# EAGLE design DeckardsHelper (EAGLE 9.5.2)
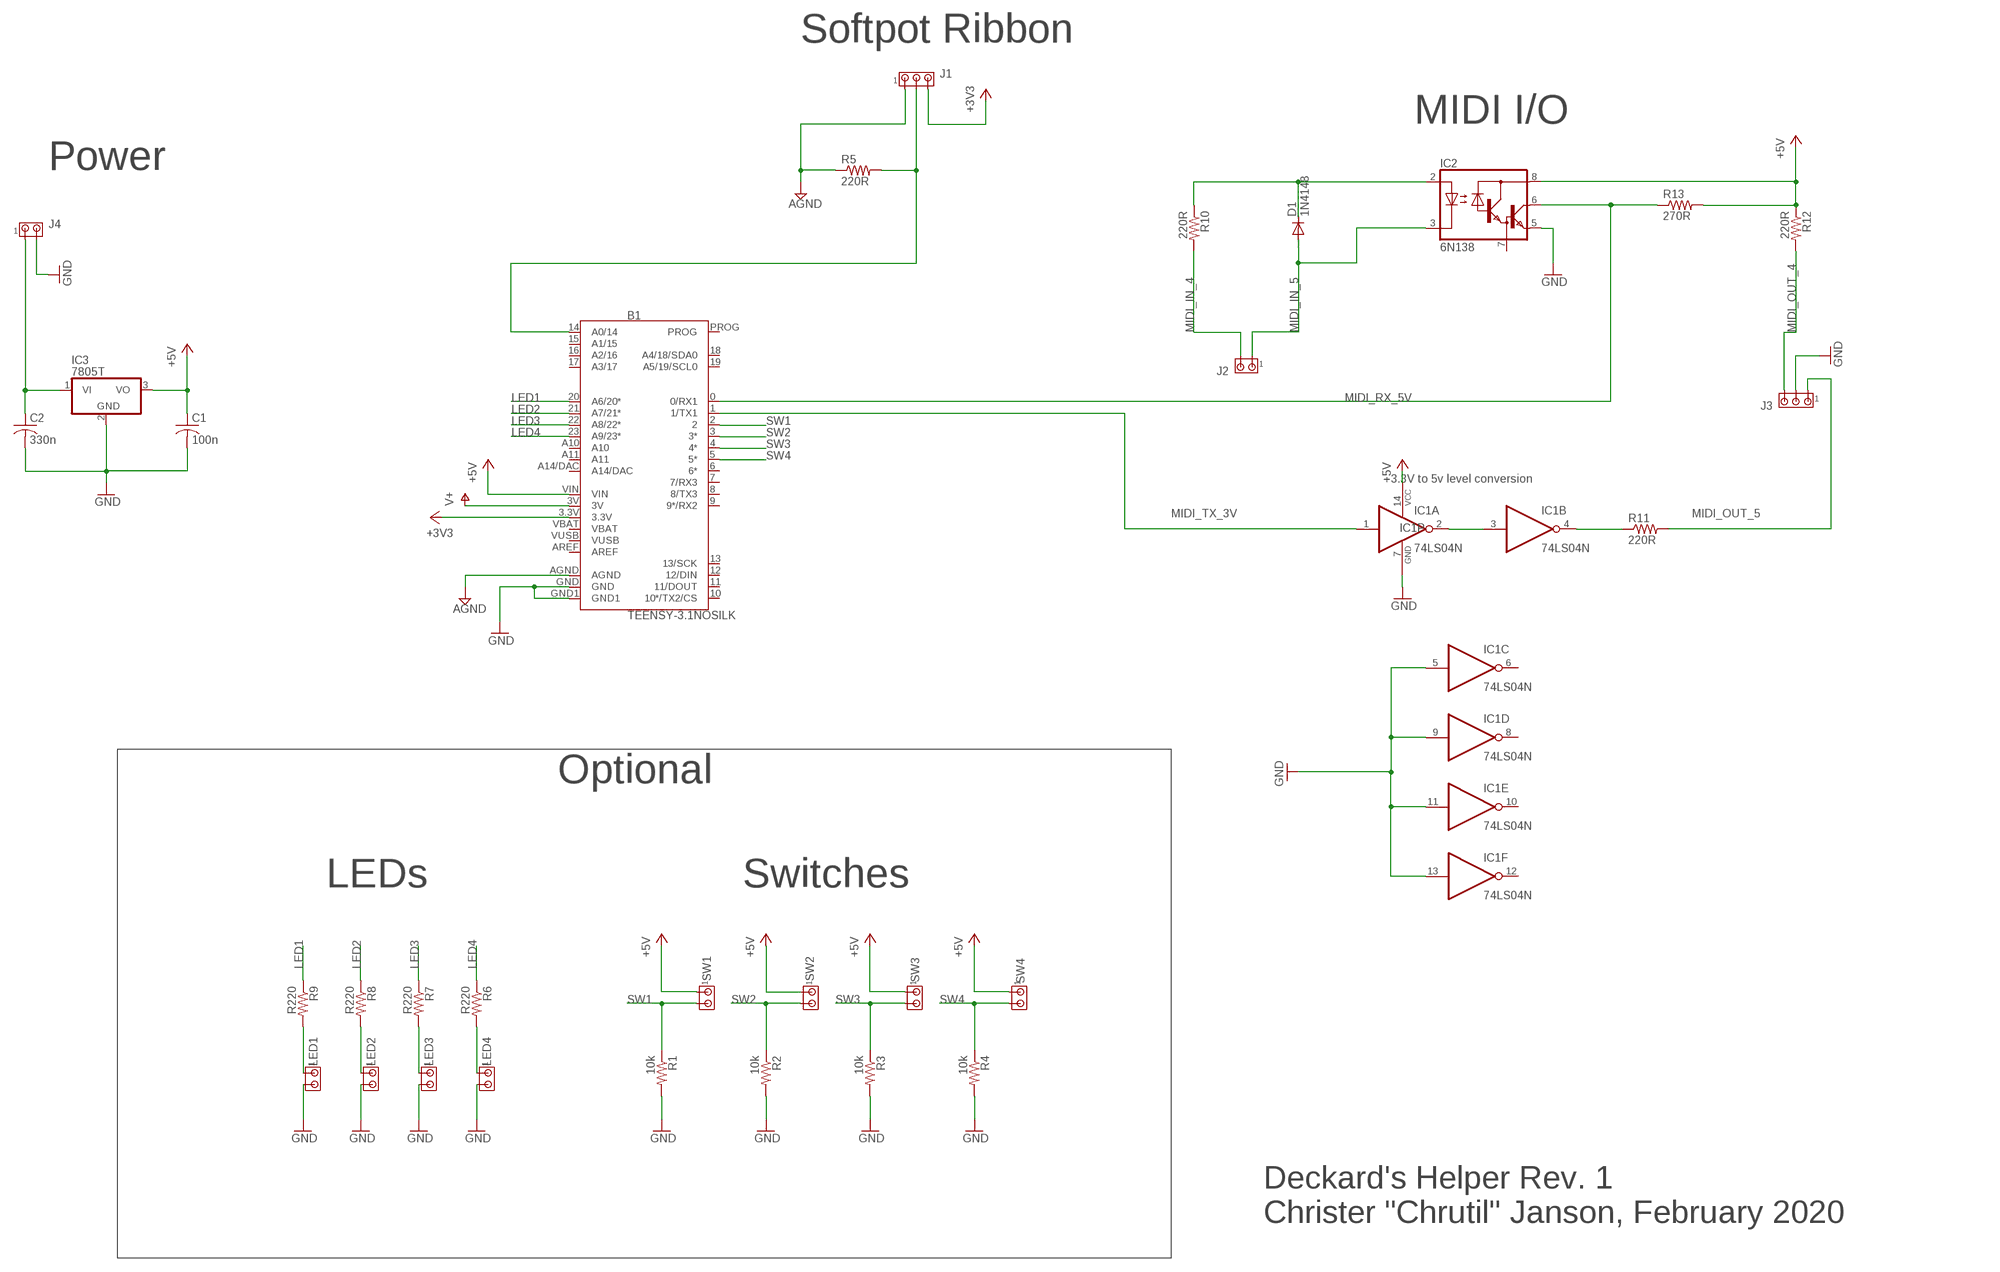
[diagram p0: schematic, sheet 1]

## Parts
B1  TEENSY-3.1NOSILK  [TEENSY-3.1_NOSILK]
C1  100n  C-US025-025X050  [C025-025X050]
C2  330n  C-US025-025X050  [C025-025X050]
D1  1N4148  1N4148DO35-7  [DO35-7]
IC1  74LS04N  [DIL14]
IC2  6N138  [DIL08]
IC3  7805T  [TO220H]
J1  MTA03-100  [10X03MTA]
J2  MTA02-100  [10X02MTA]
J3  MTA03-100  [10X03MTA]
J4  MTA02-100  [10X02MTA]
LED1  MTA02-100  [10X02MTA]
LED2  MTA02-100  [10X02MTA]
LED3  MTA02-100  [10X02MTA]
LED4  MTA02-100  [10X02MTA]
R1  10k  R-US_0204/7  [0204/7]
R2  10k  R-US_0204/7  [0204/7]
R3  10k  R-US_0204/7  [0204/7]
R4  10k  R-US_0204/7  [0204/7]
R5  220R  R-US_0204/7  [0204/7]
R6  R220  R-US_0204/7  [0204/7]
R7  R220  R-US_0204/7  [0204/7]
R8  R220  R-US_0204/7  [0204/7]
R9  R220  R-US_0204/7  [0204/7]
R10  220R  R-US_0204/7  [0204/7]
R11  220R  R-US_0204/7  [0204/7]
R12  220R  R-US_0204/7  [0204/7]
R13  270R  R-US_0204/7  [0204/7]
SW1  MTA02-100  [10X02MTA]
SW2  MTA02-100  [10X02MTA]
SW3  MTA02-100  [10X02MTA]
SW4  MTA02-100  [10X02MTA]

## Nets
+3V3: B1.3.3V J1.3
+5V: B1.VIN C1.1 IC1.14(P:VCC) IC2.8(VCC) IC3.3(VO) R12.1 R13.2 SW1.1 SW2.1 SW3.1 SW4.1
AGND: B1.AGND J1.1 R5.1
GND: B1.GND B1.GND1 C1.2 C2.2 IC1.5(C:I) IC1.7(P:GND) IC1.9(D:I) IC1.11(E:I) IC1.13(F:I) IC2.5(GND) IC3.2(GND) J3.2 J4.2 LED1.2 LED2.2 LED3.2 LED4.2 R1.2 R2.2 R3.2 R4.2
LED1: B1.20(A6/20*) R9.1
LED2: B1.21(A7/21*) R8.1
LED3: B1.22(A8/22*) R7.1
LED4: B1.23(A9/23*) R6.1
MIDI_IN_4: J2.2 R10.2
MIDI_IN_5: D1.A IC2.3(C) J2.1
MIDI_OUT_4: J3.3 R12.2
MIDI_OUT_5: J3.1 R11.2
MIDI_RX_5V: B1.0(0/RX1) IC2.6(VO) R13.1
MIDI_TX_3V: B1.1(1/TX1) IC1.1(A:I)
N$1: IC1.2(A:O) IC1.3(B:I)
N$2: IC1.4(B:O) R11.1
N$3: LED3.1 R7.2
N$4: LED2.1 R8.2
N$5: LED1.1 R9.2
N$7: B1.14(A0/14) J1.2 R5.2
N$9: LED4.1 R6.2
N$37: C2.1 IC3.1(VI) J4.1
N$45: D1.C IC2.2(A) R10.1
SW1: B1.2 R1.1 SW1.2
SW2: B1.3(3*) R2.1 SW2.2
SW3: B1.4(4*) R3.1 SW3.2
SW4: B1.5(5*) R4.1 SW4.2
V+: B1.3V
Unconnected: B1.6(6*) B1.7(7/RX3) B1.8(8/TX3) B1.9(9*/RX2) B1.10(10*/TX2/CS) B1.11(11/DOUT) B1.12(12/DIN) B1.13(13/SCK) B1.15(A1/15) B1.16(A2/16) B1.17(A3/17) B1.18(A4/18/SDA0) B1.19(A5/19/SCL0) B1.A10 B1.A11 B1.A14/DAC B1.AREF B1.PROG IC1.6(C:O) IC1.8(D:O) IC1.10(E:O) IC1.12(F:O) IC2.7(VB)

## Notes on the sheet
- Softpot Ribbon
- MIDI I/O
- Power
- 3.3V to 5v level conversion
- Optional
- LEDs | Switches
- Deckard's Helper Rev. 1
  Christer "Chrutil" Janson, February 2020

## Power pins joined to a net without a drawn wire
VBAT: B1.VBAT
VUSB: B1.VUSB

## Library data of the parts
B1 = SparkFun-Boards:TEENSY-3.1: Teensy 3+ Footprint Mechanical footprint with connectors for Teensy Development Board with ARM Cortex. SparkFun Products: Teensy 3.2 <https://www.sparkfun.com/products/13736> Teensy LC <https://www.sparkfun.com/products/13305>; SF_ID: DEV-12646
C1 C2 = rcl:C-US: CAPACITOR, American symbol
D1 = diode:1N4148: DIODE high speed (Philips)
IC1 = 74xx-us:74*04: Hex INVERTER
IC2 = 6n138:6N138: MOTOROLA OPTO COUPLER; MF: VISHAY/TELEFUNKEN; MPN: 6N138; OC_FARNELL: 9860150; OC_NEWARK: 35K5294
IC3 = adafruit:78*: Positive VOLTAGE REGULATOR Added bigger pads to the TO-92 package
J1 J3 = chrutil:MTA03-100: AMP connector
J2 J4 LED1-LED4 SW1-SW4 = chrutil:MTA02-100: AMP connector
R1-R13 = adafruit:R-US_: RESISTOR, American symbol

## Board
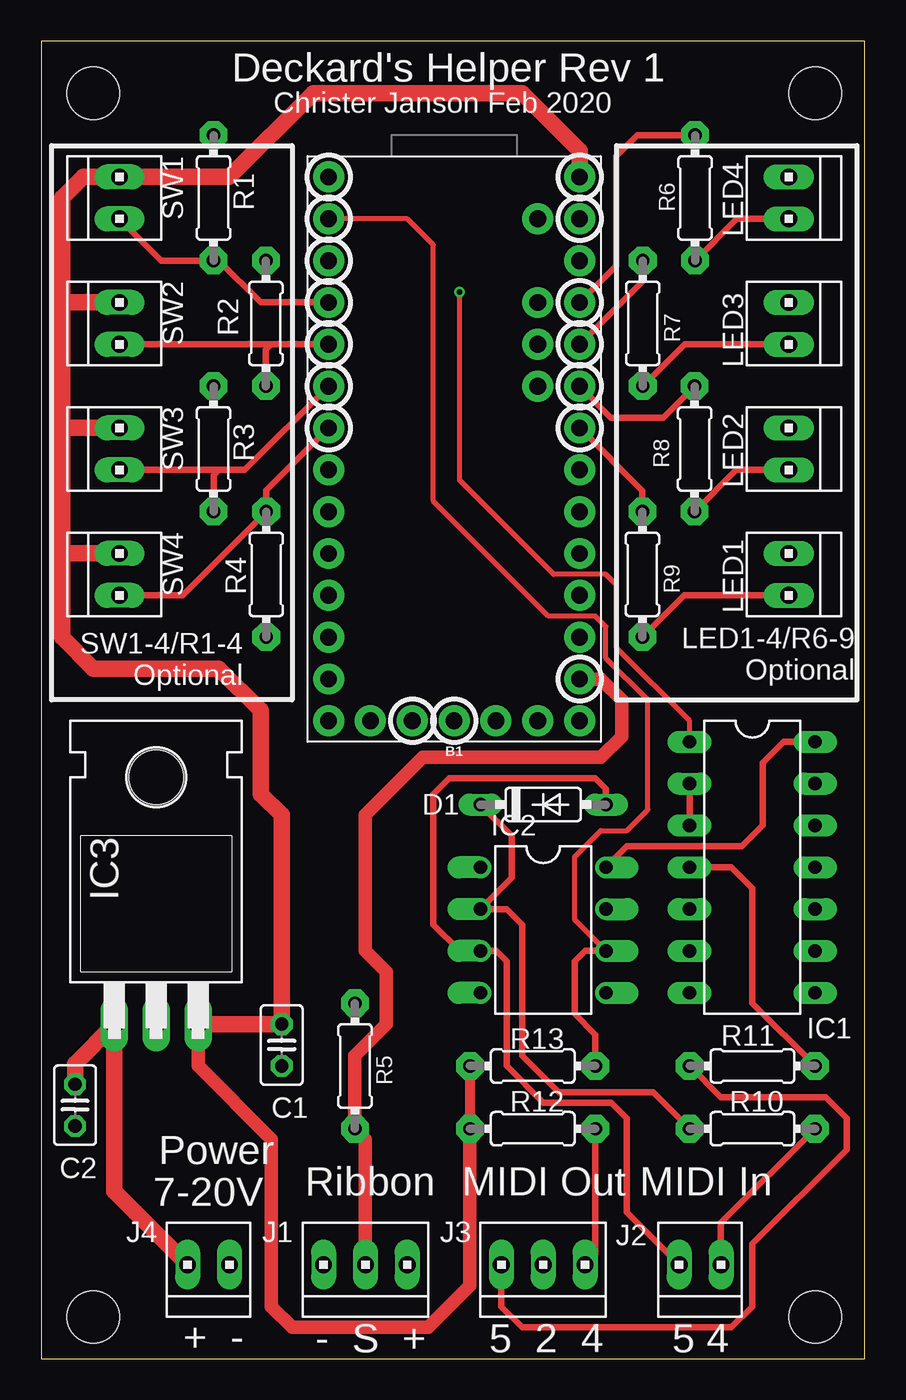
[diagram p1: board, top side]
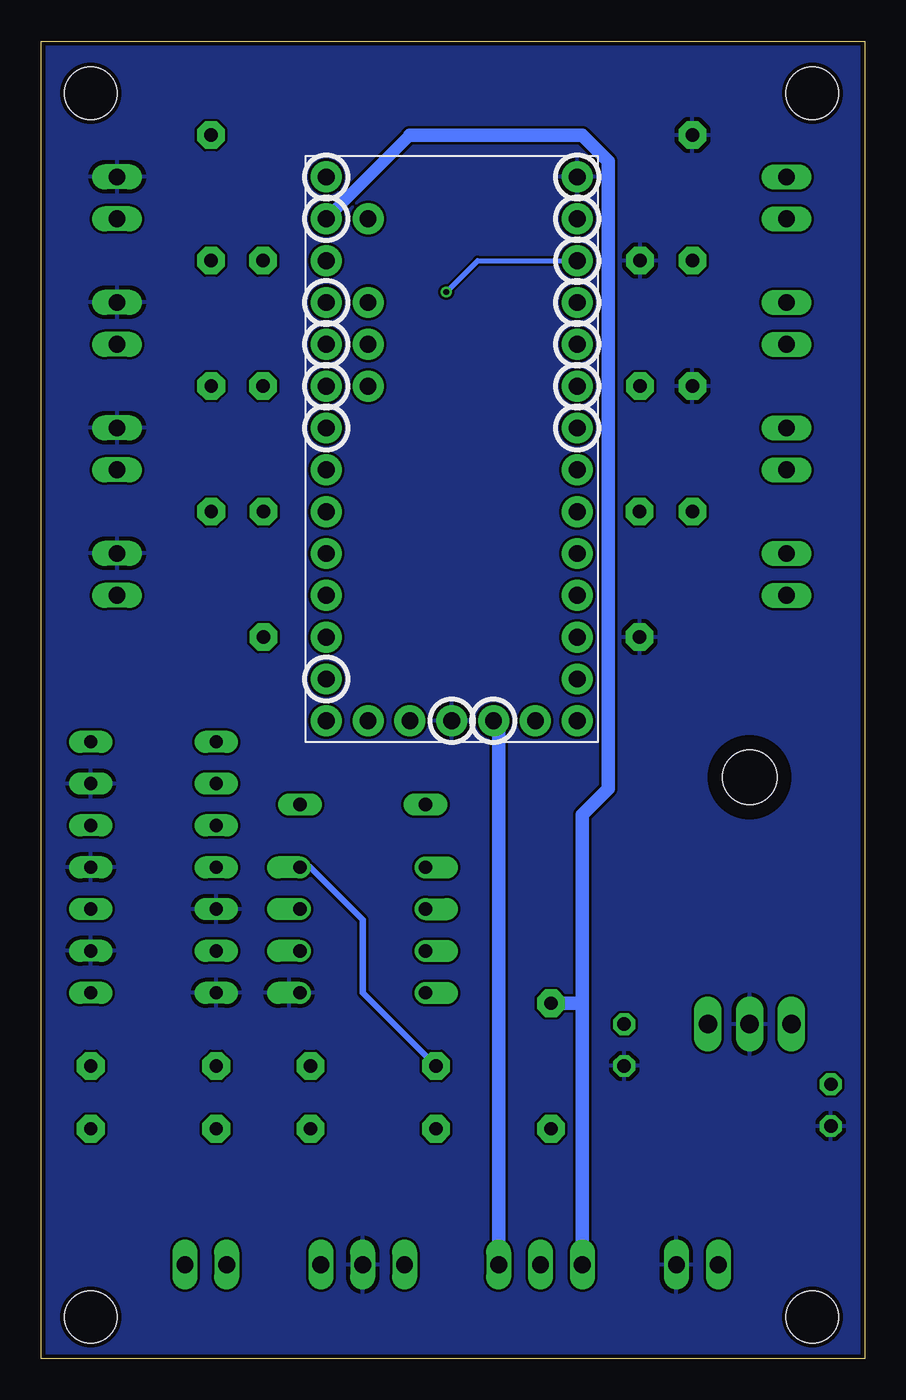
[diagram p2: board, bottom side, seen from below]

Size 50 x 80 mm. Coordinates in mm from the lower left corner, seen from the top.
Outline: 0,0 50,0 50,80 0,80 0,0
Copper layers (1*16): Top 0.035mm / dielectric 1.5mm / Bottom 0.035mm
Design rules "SeeedStudio_2layer_DRU_no_angle_20140221": minimum track width 6mil, minimum drill 12mil, track to track 6mil, track to pad 6mil, pad to pad 6mil, via to via 6mil, smd to smd 0mil, copper to edge 10mil, drill to drill 10mil, minimum pad ring 10mil, minimum via ring 6mil, stop-mask expansion 2mil, vias tented up to drill 100mil, thermal gap 10mil
Holes 3.17 mm at 3.17,2.54 46.99,2.54 46.99,76.83 3.17,76.83

### Footprints (pad centres in the part's own frame; a part is rotated, then mirrored left to right if it is on the bottom)
TEENSY-3.1_NOSILK = drill 1.016 pad 1.88: 0 7.62,-13.97; 1 7.62,-11.43; 2 7.62,-8.89; 3 7.62,-6.35; 3.3V 2.54,16.51; 3V -7.62,-11.43; 4 7.62,-3.81; 5 7.62,-1.27; 6 7.62,1.27; 7 7.62,3.81; 8 7.62,6.35; 9 7.62,8.89; 10 7.62,11.43; 11 7.62,13.97; 12 7.62,16.51; 13 -7.62,16.51; 14 -7.62,13.97; 15 -7.62,11.43; 16 -7.62,8.89; 17 -7.62,6.35; 18 -7.62,3.81; 19 -7.62,1.27; 20 -7.62,-1.27; 21 -7.62,-3.81; 22 -7.62,-6.35; 23 -7.62,-8.89; A10 -5.08,-6.35; A11 -5.08,-3.81; A14/DAC -5.08,16.51; AGND -7.62,-13.97; AREF -5.08,-8.89; GND 0,16.51; GND1 7.62,-16.51; PROG -2.54,16.51; VBAT 5.08,16.51; VIN -7.62,-16.51; VUSB -5.08,-13.97
C025-025X050 = drill 0.813 octagon: 1 -1.27,0; 2 1.27,0
DO35-7 = drill 0.813 long: A 3.81,0; C -3.81,0
DIL14 = drill 0.813 long: 1 -7.62,-3.81; 2 -5.08,-3.81; 3 -2.54,-3.81; 4 0,-3.81; 5 2.54,-3.81; 6 5.08,-3.81; 7 7.62,-3.81; 8 7.62,3.81; 9 5.08,3.81; 10 2.54,3.81; 11 0,3.81; 12 -2.54,3.81; 13 -5.08,3.81; 14 -7.62,3.81
DIL08 = drill 0.813 offset: 1 -3.81,-3.81; 2 -1.27,-3.81; 3 1.27,-3.81; 4 3.81,-3.81; 5 3.81,3.81; 6 1.27,3.81; 7 -1.27,3.81; 8 -3.81,3.81
TO220H = drill 1.118 long: 1 -2.54,-10.16; 2 0,-10.16; 3 2.54,-10.16 | hole 3.302: 0,4.826
10X03MTA = drill 1.016 long: 1 2.54,0; 2 0,0; 3 -2.54,0
10X02MTA = drill 1.016 long: 1 1.27,0; 2 -1.27,0
0204/7 = drill 0.813 pad 1.676 octagon: 1 -3.81,0; 2 3.81,0

### Placement (x,y rotation side)
B1  25.07,55.24 180 top
C1  14.61,19.05 270 top
C2  2.06,15.4 270 top
D1  30.48,33.66 0 top
IC1  43.18,29.84 270 top
IC2  30.48,26.04 270 top
IC3  6.99,30.48 0 top
J1  19.68,5.71 180 top
J2  40.01,5.71 180 top
J3  30.48,5.71 180 top
J4  10.16,5.71 180 top
LED1  45.39,47.62 270 top
LED2  45.39,55.24 270 top
LED3  45.39,62.87 270 top
LED4  45.39,70.48 270 top
R1  10.46,70.48 90 top
R2  13.64,62.87 90 top
R3  10.46,55.24 90 top
R4  13.66,47.62 270 top
R5  19.05,17.78 270 top
R6  39.7,70.48 270 top
R7  36.52,62.87 270 top
R8  39.67,55.24 270 top
R9  36.5,47.62 270 top
R10  43.18,13.97 0 top
R11  43.18,17.78 180 top
R12  29.84,13.97 0 top
R13  29.84,17.78 180 top
SW1  4.75,70.48 90 top
SW2  4.75,62.87 90 top
SW3  4.75,55.24 90 top
SW4  4.75,47.62 90 top

### Tracks (layer width: path | path; a pad name or v marks a point on that pad's centre or on a via)
+3V3
  Bottom 0.813: J1.3 22.23,38.43 B1.3.3V
+5V
  Top 0.406: IC2.8 35.56,31.11 42.55,31.11 43.81,32.38 43.81,36.2 45.09,37.47 IC1.14
  Top 0.61: R13.2 R12.1
  Top 0.813: R12.1 26.04,4.45 23.5,1.91 15.24,1.91 13.97,3.17 13.97,13.34 9.53,17.78 IC3.3
  Top 1.016: 1.27,48.9 1.27,56.52 | 1.27,56.52 1.27,64.14 | 1.27,64.14 1.27,70.48 2.54,71.75 SW1.1 11.43,71.75 16.51,76.83 29.21,76.83 32.69,73.36 B1.VIN | SW2.1 1.27,64.14 | SW3.1 1.27,56.52 | SW4.1 1.27,48.9 | IC3.3 C1.1 14.61,33.02 13.34,34.29 13.34,39.37 10.79,41.91 3.17,41.91 1.27,43.81 1.27,48.9
  Bottom 0.406: R13.2 30.48,22.23 30.48,26.67 33.66,29.84 IC2.8
AGND
  Bottom 0.762: 27.61,74.3 B1.AGND
  Bottom 0.813: J1.1 17.14,21.59 | 17.14,21.59 17.14,33.02 15.56,34.61 15.56,72.71 17.14,74.3 27.61,74.3 | R5.1 17.14,21.59
GND
  pour Bottom: 0,80.01 50,80.01 50,0 0,0
LED1
  Top 0.406: R9.1 36.5,52.7 B1.20
LED2
  Top 0.406: R8.1 37.77,57.15 34.59,57.15 B1.21
LED3
  Top 0.406: B1.22 36.52,65.43 R7.1
LED4
  Top 0.406: B1.23 34.92,66.37 34.92,73.03 36.2,74.3 R6.1
MIDI_IN_4
  Top 0.406: J2.2 41.27,8.26 R10.2
MIDI_IN_5
  Top 0.406: D1.A 34.29,34.61 33.66,35.24 24.77,35.24 23.81,34.29 23.81,26.35 25.4,24.77 IC2.3 27.62,24.77 28.26,24.13 28.26,17.78 30.48,15.56 34.61,15.56 35.56,14.61 35.56,8.89 J2.1
MIDI_OUT_4
  Top 0.406: J3.3 33.66,6.35 R12.2
MIDI_OUT_5
  Top 0.406: J3.1 27.94,3.17 29.21,1.91 41.91,1.91 43.18,3.17 43.18,6.99 48.9,12.7 48.9,14.61 47.62,15.88 41.27,15.88 R11.2
MIDI_RX_5V
  Top 0.305: IC2.6 32.38,26.67 32.38,30.48 33.97,32.07 35.56,32.07 36.83,33.34 36.83,40.01 34.29,42.55 34.29,44.45 33.66,45.09 30.8,45.09 23.81,52.07 23.81,67.63 22.23,69.22 B1.0
  Top 0.406: R13.1 33.66,19.68 32.38,20.95 32.38,24.13 33.02,24.77 IC2.6
MIDI_TX_3V  (via drill 0.35)
  Top 0.305: IC1.1 39.37,38.73 34.92,43.18 34.92,46.99 34.29,47.62 31.11,47.62 25.4,53.34 v25.4,64.77
  Bottom 0.305: v25.4,64.77 23.5,66.67 B1.1
N$1
  Top 0.406: IC1.3 IC1.2
N$2
  Top 0.406: R11.1 43.18,21.59 43.18,28.57 41.91,29.84 IC1.4
N$3
  Top 0.406: R7.2 39.06,61.59 LED3.1
N$4
  Top 0.406: R8.2 42.22,53.98 LED2.1
N$5
  Top 0.406: R9.2 39.04,46.35 LED1.1
N$7
  Top 0.813: J1.2 19.68,13.34 R5.2 19.05,18.41 20.95,20.32 20.95,23.5 19.68,24.77 19.68,33.02 23.18,36.51 33.97,36.51 35.24,37.78 35.24,40.01 33.97,41.27 B1.14
N$9
  Top 0.406: R6.2 42.24,69.22 LED4.1
N$37
  Top 1.016: J4.1 5.71,8.89 4.45,10.16 IC3.1 2.06,17.93 C2.1
N$45
  Top 0.406: D1.C 28.57,31.75 28.57,29.21 IC2.2 28.26,27.3 29.21,26.35 29.21,18.41 31.43,16.19 37.15,16.19 R10.1
SW1
  Top 0.406: B1.2 13.34,64.14 10.79,66.67 R1.1 7.29,66.67 SW1.2
SW2
  Top 0.406: B1.3 13.97,61.59 | 13.97,61.59 SW2.2 | R2.1 13.64,61.27 13.97,61.59
SW3
  Top 0.406: B1.4 12.37,53.98 10.79,53.98 | 10.79,53.98 SW3.2 | R3.1 10.46,53.65 10.79,53.98
SW4
  Top 0.406: B1.5 13.66,52.73 R4.1 8.59,46.35 SW4.2

### Text on the board
tNames: Deckard's Helper Rev 1 | Christer Janson Feb 2020 | SW1-4/R1-4 / Optional | LED1-4/R6-9 / Optional | Power | Ribbon | MIDI Out | MIDI In | 7-20V | + - | - S + | 5 2 4 | 5 4